# EAGLE design relay-shield (EAGLE 7.2.0)
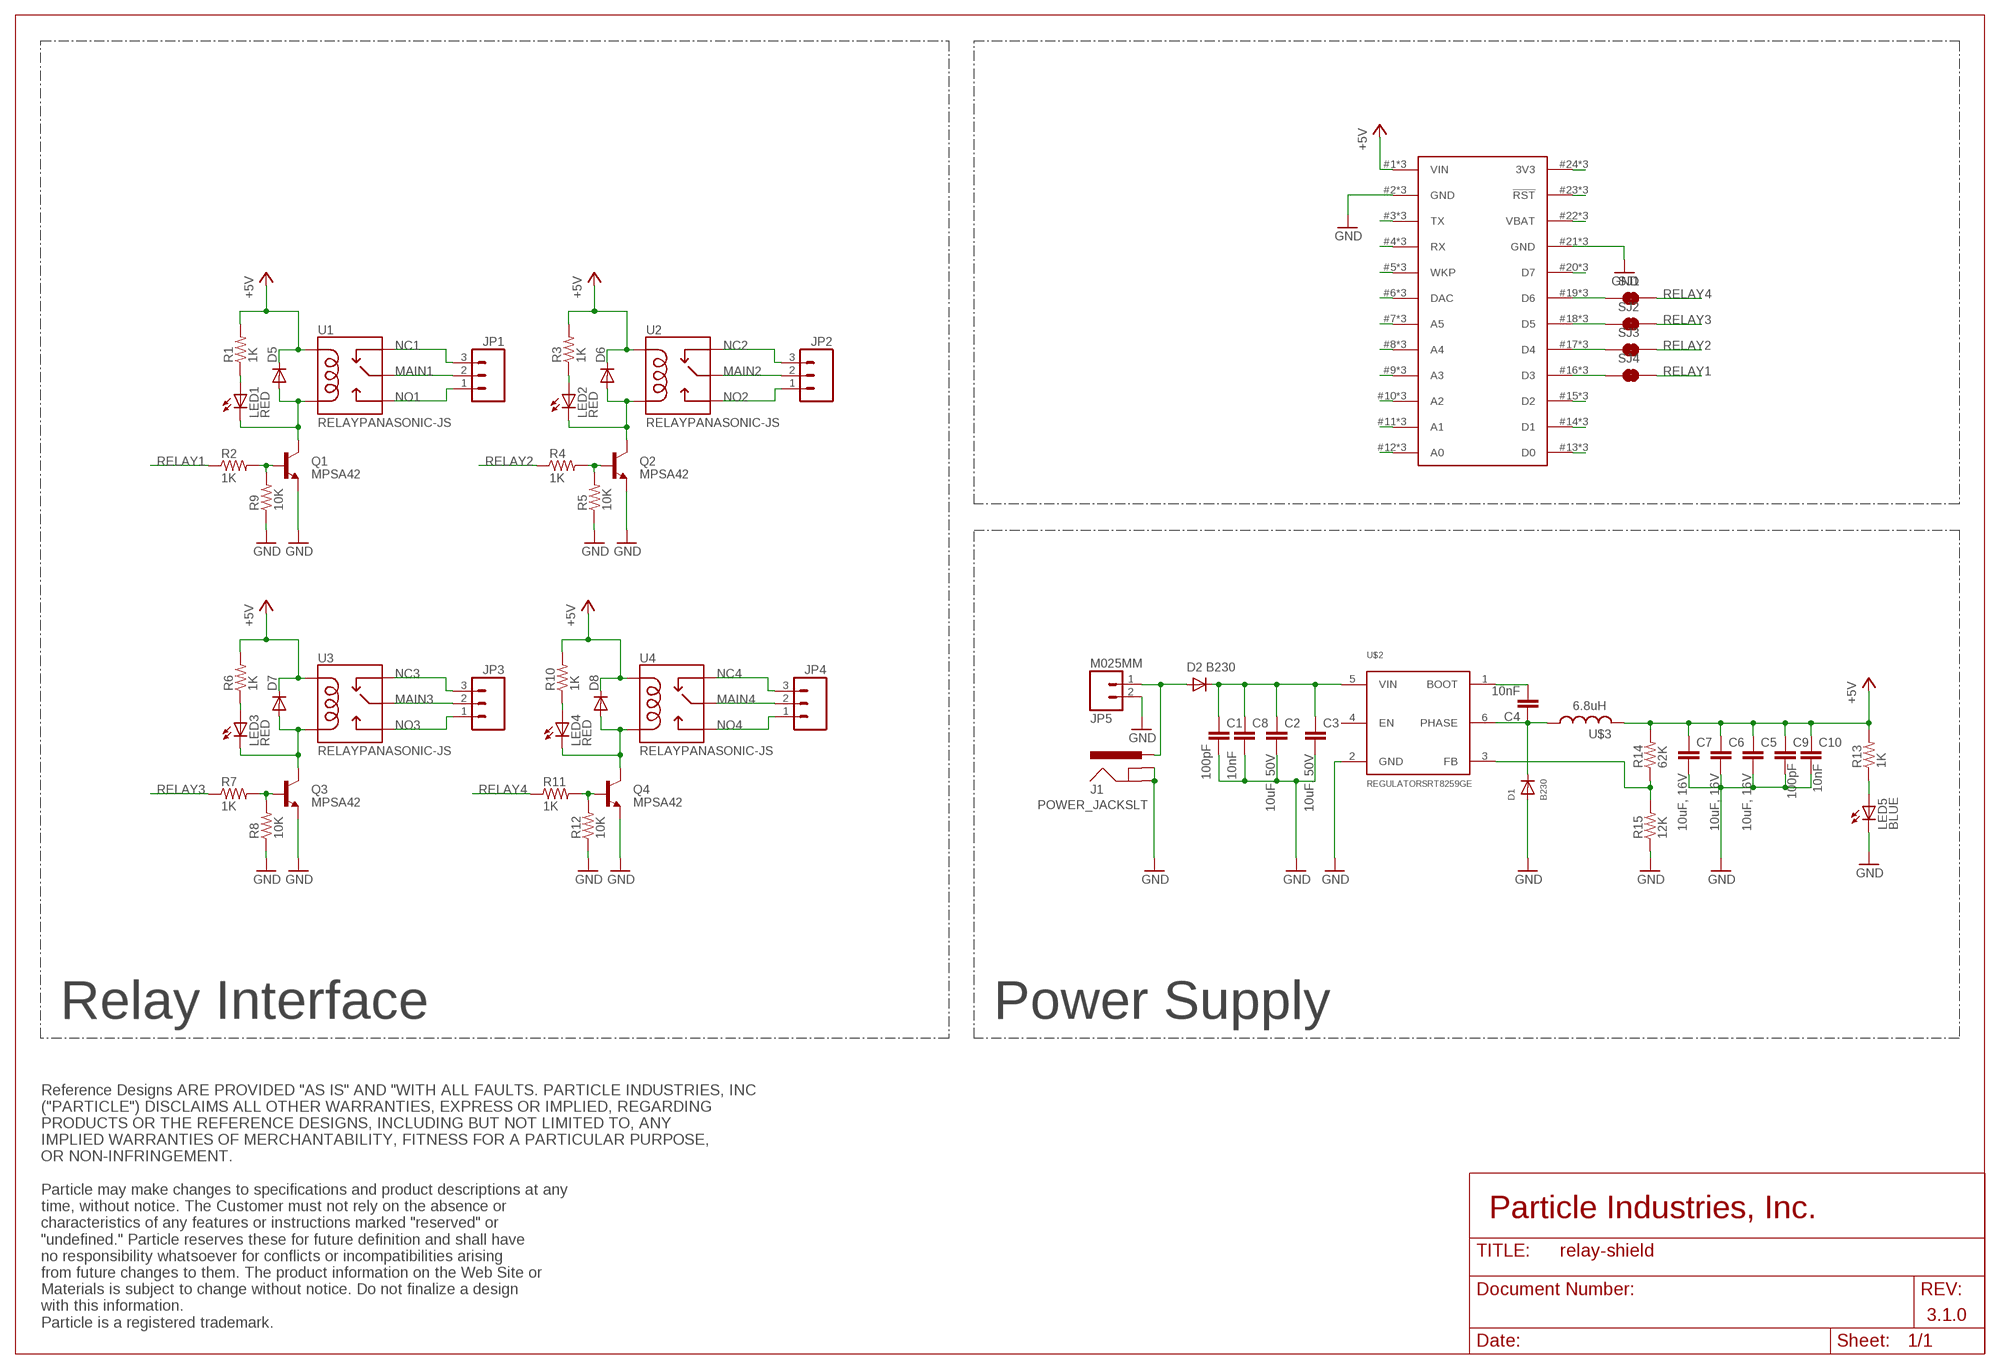
[diagram p0: schematic, sheet 1]

## Parts
C1  100pF  C-EUC0603  [C0603]
C2  10uF, 50V  CAP1206  [1206]
C3  10uF, 50V  CAP1206  [1206]
C4  10nF  CAP0603-CAP  [0603-CAP]
C5  10uF, 16V  CAP1206  [1206]
C6  10uF, 16V  CAP1206  [1206]
C7  10uF, 16V  CAP1206  [1206]
C8  10nF  C-EUC0603  [C0603]
C9  100pF  C-EUC0603  [C0603]
C10  10nF  C-EUC0603  [C0603]
D1  B230  DIODESMA  [SMADIODE]
D2  B230  DIODESMA  [SMADIODE]
D5  DIODE-SOD123  [SOD123]
D6  DIODE-SOD123  [SOD123]
D7  DIODE-SOD123  [SOD123]
D8  DIODE-SOD123  [SOD123]
J1  POWER_JACKSLT  [POWER_JACK_SLOT]
JP1  M03-SCREW-5MM  [SCREWTERMINAL-5MM-3]
JP2  M03-SCREW-5MM  [SCREWTERMINAL-5MM-3]
JP3  M03-SCREW-5MM  [SCREWTERMINAL-5MM-3]
JP4  M03-SCREW-5MM  [SCREWTERMINAL-5MM-3]
JP5  M025MM  [SCREWTERMINAL-5MM-2]
LED1  RED  LED0603  [LED-0603]
LED2  RED  LED0603  [LED-0603]
LED3  RED  LED0603  [LED-0603]
LED4  RED  LED0603  [LED-0603]
LED5  BLUE  LED0603  [LED-0603]
Q1  MPSA42  TRANSISTOR_NPNMPSA42  [SOT23]
Q2  MPSA42  TRANSISTOR_NPNMPSA42  [SOT23]
Q3  MPSA42  TRANSISTOR_NPNMPSA42  [SOT23]
Q4  MPSA42  TRANSISTOR_NPNMPSA42  [SOT23]
R1  1K  RESISTOR0603-RES  [0603-RES]
R2  1K  RESISTOR0603-RES  [0603-RES]
R3  1K  RESISTOR0603-RES  [0603-RES]
R4  1K  RESISTOR0603-RES  [0603-RES]
R5  10K  RESISTOR0603-RES  [0603-RES]
R6  1K  RESISTOR0603-RES  [0603-RES]
R7  1K  RESISTOR0603-RES  [0603-RES]
R8  10K  RESISTOR0603-RES  [0603-RES]
R9  10K  RESISTOR0603-RES  [0603-RES]
R10  1K  RESISTOR0603-RES  [0603-RES]
R11  1K  RESISTOR0603-RES  [0603-RES]
R12  10K  RESISTOR0603-RES  [0603-RES]
R13  1K  RESISTOR0603-RES  [0603-RES]
R14  62K  RESISTOR0603-RES  [0603-RES]
R15  12K  RESISTOR0603-RES  [0603-RES]
SJ1  JUMPER-PAD-2-NC_BY_TRACE  [PAD-JUMPER-2-NC_BY_TRACE_YES_SILK]
SJ2  JUMPER-PAD-2-NC_BY_TRACE  [PAD-JUMPER-2-NC_BY_TRACE_YES_SILK]
SJ3  JUMPER-PAD-2-NC_BY_TRACE  [PAD-JUMPER-2-NC_BY_TRACE_YES_SILK]
SJ4  JUMPER-PAD-2-NC_BY_TRACE  [PAD-JUMPER-2-NC_BY_TRACE_YES_SILK]
U1  RELAYPANASONIC-JS  [JS1-5V-F]
U2  RELAYPANASONIC-JS  [JS1-5V-F]
U3  RELAYPANASONIC-JS  [JS1-5V-F]
U4  RELAYPANASONIC-JS  [JS1-5V-F]
U$1  SPARK_CORESTACKABLE  [SPARK_CORE_STACKABLE]
U$2  REGULATORSRT8259GE  [SOT23-6]
U$3  INDUCTORS  [NR8040T6R8N]

## Nets
+5V: C5.1 C6.1 C7.1 C9.1 C10.1 D5.C D6.C D7.C D8.C R1.2 R3.2 R6.2 R10.2 R13.2 R14.2 U1.COIL1 U2.COIL1 U3.COIL1 U4.COIL1 U$1.1(VIN) U$1.#1(VIN) U$1.@1(VIN) U$3.P$2
GND: C1.2 C2.2 C3.2 C5.2 C6.2 C7.2 C8.2 C9.2 C10.2 D1.A J1.GND@1(GNDBREAK) J1.GND@2(GND) JP5.2 LED5.C Q1.2(E) Q2.2(E) Q3.2(E) Q4.2(E) R5.1 R8.1 R9.1 R12.1 R15.1 U$1.2(GND) U$1.21(GND) U$1.#2(GND) U$1.#21(GND) U$1.@2(GND) U$1.@21(GND) U$2.2(GND)
MAIN1: JP1.2 U1.COMMON(MAIN)
MAIN2: JP2.2 U2.COMMON(MAIN)
MAIN3: JP3.2 U3.COMMON(MAIN)
MAIN4: JP4.2 U4.COMMON(MAIN)
N$1: D5.A LED1.C Q1.3(C) U1.COIL2
N$2: Q2.1(B) R4.2 R5.2
N$3: Q1.1(B) R2.2 R9.2
N$4: LED1.A R1.1
N$5: D6.A LED2.C Q2.3(C) U2.COIL2
N$6: LED2.A R3.1
N$7: Q3.1(B) R7.2 R8.2
N$8: D7.A LED3.C Q3.3(C) U3.COIL2
N$9: LED3.A R6.1
N$10: Q4.1(B) R11.2 R12.2
N$11: D8.A LED4.C Q4.3(C) U4.COIL2
N$12: LED4.A R10.1
N$13: U$1.15(D2) U$1.#15(D2) U$1.@15(D2)
N$14: C1.1 C2.1 C3.1 C8.1 D2.C U$2.5(VIN)
N$15: U$1.14(D1) U$1.#14(D1) U$1.@14(D1)
N$16: LED5.A R13.1
N$17: U$1.13(D0) U$1.#13(D0) U$1.@13(D0)
N$18: U$1.20(D7) U$1.#20(D7) U$1.@20(D7)
N$19: U$1.22(VBAT) U$1.#22(VBAT) U$1.@22(VBAT)
N$20: U$1.23(!RST) U$1.#23(!RST) U$1.@23(!RST)
N$21: U$1.24(3V3) U$1.#24(3V3) U$1.@24(3V3)
N$22: U$1.12(A0) U$1.#12(A0) U$1.@12(A0)
N$23: U$1.11(A1) U$1.#11(A1) U$1.@11(A1)
N$24: U$1.10(A2) U$1.#10(A2) U$1.@10(A2)
N$25: U$1.9(A3) U$1.#9(A3) U$1.@9(A3)
N$26: U$1.8(A4) U$1.#8(A4) U$1.@8(A4)
N$27: U$1.7(A5) U$1.#7(A5) U$1.@7(A5)
N$28: U$1.6(DAC) U$1.#6(DAC) U$1.@6(DAC)
N$29: U$1.5(WKP) U$1.#5(WKP) U$1.@5(WKP)
N$30: U$1.4(RX) U$1.#4(RX) U$1.@4(RX)
N$31: U$1.3(TX) U$1.#3(TX) U$1.@3(TX)
N$32: D2.A J1.PWR JP5.1
N$34: SJ1.1 U$1.19(D6) U$1.#19(D6) U$1.@19(D6)
N$35: C4.1 D1.C U$2.6(PHASE) U$3.P$1
N$36: C4.2 U$2.1(BOOT)
N$143: SJ2.1 U$1.18(D5) U$1.#18(D5) U$1.@18(D5)
N$144: R14.1 R15.2 U$2.3(FB)
N$145: SJ3.1 U$1.17(D4) U$1.#17(D4) U$1.@17(D4)
N$146: SJ4.1 U$1.16(D3) U$1.#16(D3) U$1.@16(D3)
NC1: JP1.3 U1.CLOSED(NC)
NC2: JP2.3 U2.CLOSED(NC)
NC3: JP3.3 U3.CLOSED(NC)
NC4: JP4.3 U4.CLOSED(NC)
NO1: JP1.1 U1.OPEN(NO)
NO2: JP2.1 U2.OPEN(NO)
NO3: JP3.1 U3.OPEN(NO)
NO4: JP4.1 U4.OPEN(NO)
RELAY1: R2.1 SJ4.2
RELAY2: R4.1 SJ3.2
RELAY3: R7.1 SJ2.2
RELAY4: R11.1 SJ1.2
Unconnected: U$2.4(EN)

## Notes on the sheet
- 6.8uH
- Relay Interface | Power Supply
- Particle Industries, Inc.
- 3.1.0
- Reference Designs ARE PROVIDED "AS IS" AND "WITH ALL FAULTS. PARTICLE INDUSTRIES, INC 
  ("PARTICLE") DISCLAIMS ALL OTHER WARRANTIES, EXPRESS OR IMPLIED, REGARDING 
  PRODUCTS OR THE REFERENCE DESIGNS, INCLUDING BUT NOT LIMITED TO, ANY 
  IMPLIED WARRANTIES OF MERCHANTABILITY, FITNESS FOR A PARTICULAR PURPOSE,
  OR NON-INFRINGEMENT.
  
  Particle may make changes to specifications and product descriptions at any 
  time, without notice. The Customer must not rely on the absence or 
  characteristics of any features or instructions marked "reserved" or 
  "undefined." Particle reserves these for future definition and shall have 
  no responsibility whatsoever for conflicts or incompatibilities arising 
  from future changes to them. The product information on the Web Site or 
  Materials is subject to change without notice. Do not finalize a design 
  with this information. 
  Particle is a registered trademark.

## Library data of the parts
C1 C8-C10 = rcl:C-EU: CAPACITOR, European symbol
C2-C7 = SparkFun-Capacitors:CAP: Capacitor Standard 0603 ceramic capacitor, and 0.1" leaded capacitor.
D1 D2 = adafruit:DIODE: Diode SMADIODE - SMA Surface Mount Package 20V 1A Schottky Diode Digikey: 641-1014-6-ND DO-1N4148 - Through Hole Small Current Diode SOD-123 20V 1 A (.5mV Vf) Schottky Diode - Digikey: MBRX120TPMSCT-ND SOD-323 10V 570mA (.38mV Vf, 3ns) Schottky Diode - Digikey: ZLLS410CT-ND SOD-523 30V 30mA Schottky Diode (RB751S-40TE61) - Digikey: RB751S-40TE61CT-ND SOT23-R/W - SOT23 Package (R = Solder Paste/Reflow Ovens, W = Hand-Soldering) BAT54Film 40V 300mA - Digikey: 497-7162-1-ND
D5-D8 = diode:DIODE-: DIODE
J1 = Spark:POWER_JACK: Power Jack This is the standard 5.5mm barrel jack for power. The PTH is the most common, proven, reliable, footprint. The Slot footprint only works if the mill layer is transmitted to the PCB fab house so be warned. Spark Fun Electronics SKU : PRT-00119 SMT: CONN-08106 Mating wall wart : TOL-00298 (and others)
JP1-JP4 = SparkFun-Connectors:M03: Header 3 Standard 3-pin 0.1" header. Use with straight break away headers (SKU : PRT-00116), right angle break away headers (PRT-00553), swiss pins (PRT-00743), machine pins (PRT-00117), and female headers (PRT-00115). Molex polarized connector foot print use with SKU : PRT-08232 with associated crimp pins and housings.
JP5 = SparkFun-Connectors:M02: Standard 2-pin 0.1" header. Use with - straight break away headers ( PRT-00116) - right angle break away headers (PRT-00553) - swiss pins (PRT-00743) - machine pins (PRT-00117) - female headers (PRT-00115) Molex polarized connector foot print use with: PRT-08233 with associated crimp pins and housings. 2.54_SCREWTERM for use with PRT-10571. 3.5mm Screw Terminal footprints for PRT-08084 5mm Screw Terminal footprints for use with PRT-08433
LED1-LED5 = SparkFun-LED:LED: LEDs Standard schematic elements and footprints for 5mm, 3mm, 1206, and 0603 sized LEDs. 5mm - Spark Fun Electronics SKU : COM-00529 (and others)
Q1-Q4 = SparkFun-DiscreteSemi:TRANSISTOR_NPN: Generic NPN BJT MMBT2222A - TRANS-08049 (SOT-23, 1A 40V) MPSA42 - TRANS-09116 (SOT-23, 500mA 300V) MMBT5088LT1G - TRANS-11160 (SOT-23, 50 mA 30V); PROD_ID: TRANS-09116
R1-R15 = SparkFun-Passives:RESISTOR: Resistor Basic schematic elements and footprints for 0603, 1206, and PTH resistors.
SJ1-SJ4 = SparkFun-Passives:JUMPER-PAD-2-NC_BY_TRACE
U1-U4 = Spark:RELAY: SPDT relay (COM-00101)
U$1 = Spark:SPARK_CORE
U$2 = mohit-eagle:REGULATORS
U$3 = mohit-eagle:INDUCTORS

## Board
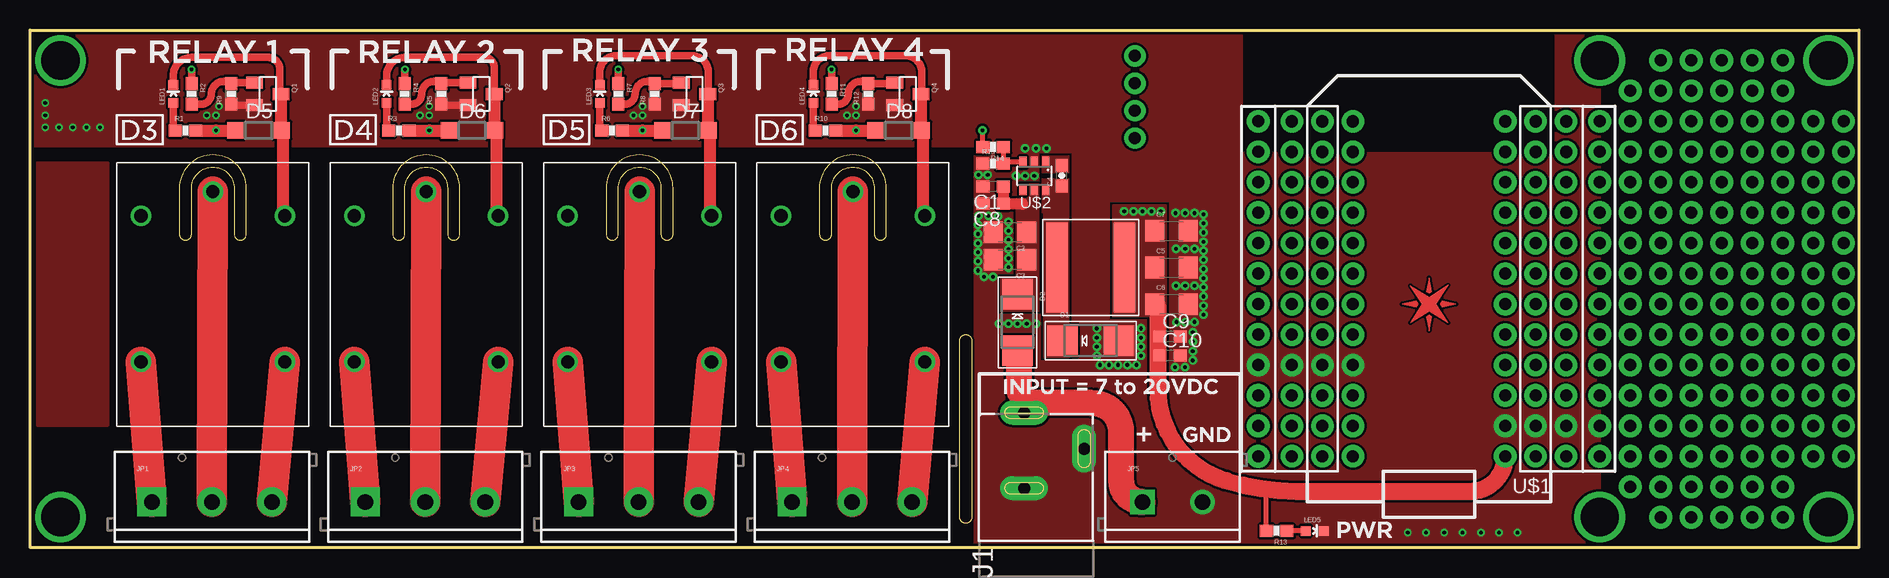
[diagram p1: board, top side]
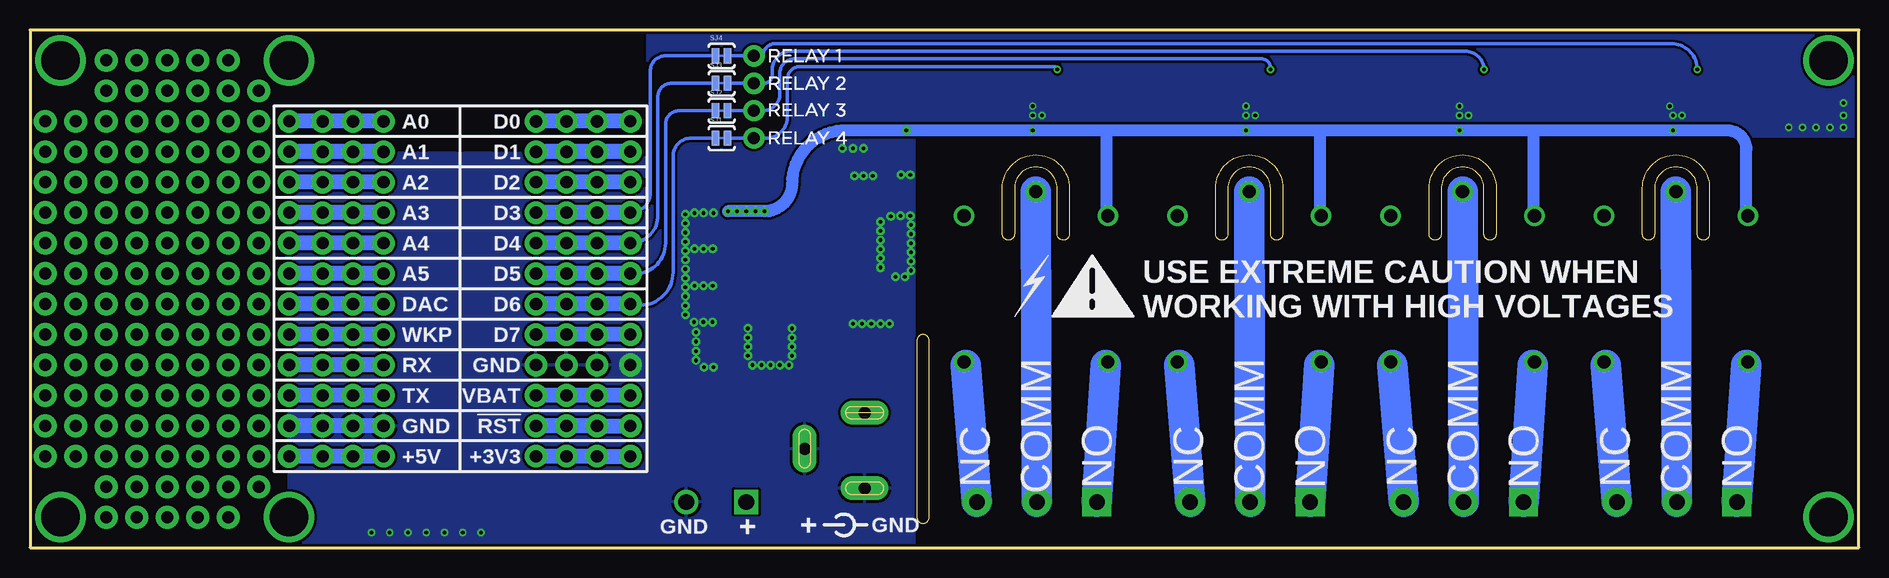
[diagram p2: board, bottom side, seen from below]

Size 152.4 x 43.18 mm. Coordinates in mm from the lower left corner, seen from the top.
Outline: 13.46,26.16 13.46,29.97 arc-90 15.24,31.75 arc-90 17.02,29.97 17.02,26.16 arc180 18.03,26.16 18.03,29.97 arc90 15.24,32.77 arc85 12.45,30.23 12.45,26.16 arc180 13.46,26.16
Outline: 31.24,26.16 31.24,29.97 arc-90 33.02,31.75 arc-90 34.8,29.97 34.8,26.16 arc180 35.81,26.16 35.81,29.97 arc90 33.02,32.77 arc85 30.23,30.23 30.23,26.16 arc180 31.24,26.16
Outline: 49.02,26.16 49.02,29.97 arc-90 50.8,31.75 arc-90 52.58,29.97 52.58,26.16 arc180 53.59,26.16 53.59,29.97 arc90 50.8,32.77 arc85 48.01,30.23 48.01,26.16 arc180 49.02,26.16
Outline: 66.8,26.16 66.8,29.97 arc-90 68.58,31.75 arc-90 70.36,29.97 70.36,26.16 arc180 71.37,26.16 71.37,29.97 arc90 68.58,32.77 arc85 65.79,30.23 65.79,26.16 arc180 66.8,26.16
Outline: 0,0 0,43.18 152.4,43.18 152.4,0 0,0
Outline: 77.47,2.54 77.47,17.27 arc-90 77.98,17.78 arc-90 78.49,17.27 78.49,2.54 arc-90 77.98,2.03 arc-90 77.47,2.54
Copper layers (1*16): Top 0.035mm / dielectric 1.5mm / Bottom 0.035mm
Design rules "SparkFun-2-layer *": minimum track width 7mil, minimum drill 15mil, track to track 8mil, track to pad 8mil, pad to pad 8mil, via to via 8mil, smd to smd 8mil, copper to edge 8mil, drill to drill 8mil, minimum pad ring 12mil, minimum via ring 6mil, stop-mask expansion 4mil, vias tented up to drill 20mil, thermal gap 10mil
tRestrict: area 101.1,33 to 127,43.2
bRestrict: area 101.1,33 to 127,43.2

### Footprints (pad centres in the part's own frame; a part is rotated, then mirrored left to right if it is on the bottom)
C0603 = smd 1.1 x 1: 1 -0.85,0; 2 0.85,0
1206 = smd 1.6 x 1.8: 1 -1.4,0; 2 1.4,0
0603-CAP = smd 1.1 x 1: 1 -0.85,0; 2 0.85,0
SMADIODE = smd 2.54 x 2.54: A 2.349,0; C -2.349,0
SOD123 = smd 1.4 x 1.4: A 1.9,0; C -1.9,0
POWER_JACK_SLOT = drill 1 pad 2 long: GND@1 2.58,7.5; GND@2 7.58,10.8; PWR 2.58,13.8
SCREWTERMINAL-5MM-3 = drill 1.3 pad 2.413 square: 1 0,0 | drill 1.3 pad 2.413: 2 5,0; 3 10,0
SCREWTERMINAL-5MM-2 = drill 1.3 pad 2.032 square: 1 0,0 | drill 1.3 pad 2.032: 2 5,0
LED-0603 = smd 0.8 x 0.8: A 0,-0.75; C 0,0.75
SOT23 = smd 1 x 1.4: 1 -0.95,-1.1; 2 0.95,-1.1; 3 0,1.1
0603-RES = smd 1.1 x 1: 1 -0.85,0; 2 0.85,0
PAD-JUMPER-2-NC_BY_TRACE_YES_SILK = smd 0.635 x 1.27: 1 -0.508,0; 2 0.508,0
JS1-5V-F = drill 1.1: CLOSED -6.096,-5.994; COIL1 6.096,5.994; COIL2 6.096,-5.994; COMMON 8.103,0; OPEN -6.096,5.994
SPARK_CORE_STACKABLE = drill 1.016 pad 1.88: 1 -8.89,13.97; 2 -8.89,11.43; 3 -8.89,8.89; 4 -8.89,6.35; 5 -8.89,3.81; 6 -8.89,1.27; 7 -8.89,-1.27; 8 -8.89,-3.81; 9 -8.89,-6.35; 10 -8.89,-8.89; 11 -8.89,-11.43; 12 -8.89,-13.97; 13 8.89,-13.97; 14 8.89,-11.43; 15 8.89,-8.89; 16 8.89,-6.35; 17 8.89,-3.81; 18 8.89,-1.27; 19 8.89,1.27; 20 8.89,3.81; 21 8.89,6.35; 22 8.89,8.89; 23 8.89,11.43; 24 8.89,13.97; #1 -6.35,13.97; #2 -6.35,11.43; #3 -6.35,8.89; #4 -6.35,6.35; #5 -6.35,3.81; #6 -6.35,1.27; #7 -6.35,-1.27; #8 -6.35,-3.81; #9 -6.35,-6.35; #10 -6.35,-8.89; #11 -6.35,-11.43; #12 -6.35,-13.97; #13 11.43,-13.97; #14 11.43,-11.43; #15 11.43,-8.89; #16 11.43,-6.35; #17 11.43,-3.81; #18 11.43,-1.27; #19 11.43,1.27; #20 11.43,3.81; #21 11.43,6.35; #22 11.43,8.89; #23 11.43,11.43; #24 11.43,13.97; @1 -11.43,13.97; @2 -11.43,11.43; @3 -11.43,8.89; @4 -11.43,6.35; @5 -11.43,3.81; @6 -11.43,1.27; @7 -11.43,-1.27; @8 -11.43,-3.81; @9 -11.43,-6.35; @10 -11.43,-8.89; @11 -11.43,-11.43; @12 -11.43,-13.97; @13 6.35,-13.97; @14 6.35,-11.43; @15 6.35,-8.89; @16 6.35,-6.35; @17 6.35,-3.81; @18 6.35,-1.27; @19 6.35,1.27; @20 6.35,3.81; @21 6.35,6.35; @22 6.35,8.89; @23 6.35,11.43; @24 6.35,13.97
SOT23-6 = smd 0.6 x 0.9: 1 -0.95,-1.15; 2 0,-1.15; 3 0.95,-1.15; 4 0.95,1.15; 5 0,1.15; 6 -0.95,1.15
NR8040T6R8N = smd 1.8 x 7.5: P$1 -2.8,0; P$2 2.8,0

### Placement (x,y rotation side)
C1  80.26,30.12 180 top
C2  81.66,26.29 180 top
C3  81.66,24 180 top
C4  85.98,31.01 90 top
C5  95.12,23.37 0 top
C6  95.12,20.32 0 top
C7  95.12,26.42 0 top
C8  80.26,28.7 180 top
C9  95,17.63 0 top
C10  95,16.05 0 top
D1  88.39,17.27 0 top
D2  82.3,18.8 270 top
D5  19.05,34.8 0 top
D6  36.83,34.8 0 top
D7  54.61,34.8 0 top
D8  72.39,34.8 0 top
E$1  [SPARK_LOGO_PLUS_PLANE]  116.59,20.32 90 top
J1  80.26,-2.54 0 top
JP1  10.16,3.81 0 top
JP2  27.94,3.81 0 top
JP3  45.72,3.81 0 top
JP4  63.5,3.81 0 top
JP5  92.71,3.81 0 top
LED1  11.94,37.85 0 top
LED2  29.72,37.85 0 top
LED3  47.5,37.85 0 top
LED4  65.28,37.85 0 top
LED5  107.06,1.4 270 top
Q1  19.81,37.85 270 top
Q2  37.59,37.85 270 top
Q3  55.37,37.85 270 top
Q4  73.15,37.85 270 top
R1  12.95,34.8 0 top
R2  13.46,37.85 270 top
R3  30.73,34.8 0 top
R4  31.24,37.85 270 top
R5  34.29,37.85 90 top
R6  48.51,34.8 0 top
R7  49.02,37.85 270 top
R8  52.07,37.85 90 top
R9  16.76,37.85 90 top
R10  66.29,34.8 0 top
R11  66.8,37.85 270 top
R12  69.85,37.85 90 top
R13  103.89,1.4 180 top
R14  80.26,33.43 180 top
R15  80.24,32.03 0 top
SJ1  94.77,34.16 0 bottom
SJ2  94.77,36.45 0 bottom
SJ3  94.77,38.73 0 bottom
SJ4  94.77,41.02 0 bottom
U1  15.24,21.59 90 top
U2  33.02,21.59 90 top
U3  50.8,21.59 90 top
U4  68.58,21.59 90 top
U$1  116.59,21.59 180 top
U$2  83.69,31.01 180 top
U$3  88.39,23.37 0 top

### Tracks (layer width: path | path; a pad name or v marks a point on that pad's centre or on a via)
+5V  (via drill 0.3, 0.3 pad 0.71, 1 pad 1.9)
  Top 0.406: R14.2 79.41,34.76 arc90 v79.38,34.8 | R13.2 103.04,4.45 | 103.04,4.45 103.04,4.61 arc-90 103.25,4.83 | 99.69,5.59 103.04,4.45
  Top 0.914: C10.1 93.98,16.05 93.98,17.12 | C9.1 93.98,17.63 93.98,19.86
  Top 1.016: R1.2 v15.49,34.8 D5.C | R3.2 v33.27,34.8 D6.C | R6.2 v51.05,34.8 D7.C | R10.2 v68.83,34.8 D8.C | C6.1
  Top 1.422: C6.1 arc-90 93.98,20.06 93.98,19.86 93.98,17.12 93.98,13.21 arc74 99.69,5.59 arc19 107.06,4.7 120.02,4.7 arc90 U$1.#1
  Bottom 1.016: U1.COIL1 9.37,27.69 9.37,33.24 arc-90 10.92,34.8 v15.49,34.8 26.92,34.8 | U3.COIL1 44.92,27.69 44.92,34.58 44.7,34.8 | U4.COIL1 62.7,27.69 62.7,34.77 62.74,34.8 | U2.COIL1 27.14,27.69 27.14,34.58 26.92,34.8 | 26.92,34.8 v33.27,34.8 44.7,34.8 | 44.7,34.8 v51.05,34.8 62.74,34.8 | 62.74,34.8 v68.83,34.8 v79.38,34.8 84.45,34.8 arc-90 88.9,30.35 arc90 v91.19,28.07 | 90.81,28.07 v91.19,28.07 | v91.19,28.07 v94.23,28.07
  Bottom 1.27: U$1.#1 U$1.1 U$1.@1 v130.81,7.62
  other vias: 93.47,28.07 92.71,28.07 91.95,28.07
  pour Top (no thermals): 90.17,19.3 94.74,19.3 94.74,28.57 90.17,28.57
GND  (via drill 0.3, 0.3 pad 0.71, 1 pad 1.9)
  Top 0.61: Q2.2 34.39,36.9 R5.1 | Q1.2 16.86,36.9 R9.1
  Bottom 1.27: U$1.#2 U$1.2 U$1.@2 v130.81,10.16
  other vias: 14.73,36.07 15.49,36.07 15.75,36.83 33.27,36.07 32.51,36.07 33.27,36.83 51.05,36.07 51.05,36.83 50.29,36.07 68.83,36.07 68.83,36.83 68.07,36.07 1.27,36.07 1.27,37.08 1.27,35.05 123.95,1.27 122.43,1.27 120.9,1.27 119.38,1.27 117.86,1.27 116.33,1.27 114.81,1.27 2.41,35.05 3.56,35.05 4.7,35.05 5.84,35.05 82.17,31.01 78.99,26.92 78.99,26.16 78.99,25.4 78.99,24.64 78.99,23.88 78.99,23.11 79.5,22.61 95.45,27.91 96.27,27.91 97.03,27.91 97.79,27.81 97.79,27.05 97.79,26.29 97.79,25.53 97.79,24.77 97.79,24 97.79,23.24 97.79,22.48 97.79,21.72 97.79,20.95 97.79,20.19 97.79,19.43 97.05,18.82 96.29,18.82 95.53,18.82 97.03,21.84 96.27,21.84 97.03,24.92 96.27,24.92 95.5,24.92 95.5,21.84 89.15,15.24 89.92,15.24 90.68,15.24 91.44,15.24 92.2,15.24 92.58,16 92.58,16.76 92.58,17.53 92.58,18.29 88.9,16 88.9,16.76 88.9,17.53 88.9,18.29 83.82,18.67 82.93,31.01 83.69,31.01 83.82,33.3 84.71,33.3 82.93,33.3 81.53,27.18 81.53,26.42 81.53,25.65 81.53,24.89 81.53,24.13 81.53,23.37 80.26,22.61 83.06,18.67 82.3,18.67 81.53,18.67 80.77,18.67 96.9,17.96 96.9,17.2 96.9,16.38 96.9,15.62 96.24,15.06 95.43,15.06 79.04,27.69 79.86,27.69 79.04,31.09 79.81,31.09 80.67,27.64 102.36,15.24
  pour Bottom (rank 2): 130.81,0 130.81,43.18 0,43.18 0,34.29 78.74,34.29 78.74,0
  pour Top (rank 2, no thermals): 130.81,0 130.81,43.18 0,43.18 0,33.53 78.74,33.53 78.74,0
MAIN1
  Top 2.54: JP1.2 U1.COMMON
  Bottom 2.54: JP1.2 15.24,29.72
MAIN2
  Top 2.54: JP2.2 U2.COMMON
  Bottom 2.54: JP2.2 33.02,29.72
MAIN3
  Top 2.54: JP3.2 U3.COMMON
  Bottom 2.54: JP3.2 50.8,29.72
MAIN4
  Top 2.54: JP4.2 U4.COMMON
  Bottom 2.54: JP4.2 68.58,29.72
N$1
  Top 0.406: 20.83,37.93 Q1.3
  Top 0.61: LED1.C 11.94,39.37 arc-90 13.46,40.89 19.81,40.89 arc-90 20.83,39.88 20.83,37.93 arc90 Q1.3
  Top 1.016: U1.COIL2 21.11,27.69 21.11,34.63 D5.A 20.95,37.81 Q1.3
N$2
  Top 0.61: Q2.1 34.39,38.8 R5.2 | 34.2,38.61 R5.2 | R4.2 31.79,37 arc90 32.64,37.85 arc-126 R5.2
N$3
  Top 0.61: Q1.1 16.86,38.8 R9.2 | 16.68,38.61 R9.2 | R2.2 14.26,37 arc90 15.11,37.85 arc-126 R9.2
N$4
  Top 0.61: LED1.A 11.94,34.96 R1.1
N$5
  Top 0.406: 38.86,38.02 Q2.3
  Top 0.61: LED2.C 29.72,39.37 arc-90 31.24,40.89 37.85,40.89 arc-90 38.69,40.05 Q2.3 arc90 38.86,38.02
  Top 1.016: U2.COIL2 38.9,27.69 38.9,34.63 D6.A 38.73,37.81 Q2.3
N$6
  Top 0.61: LED2.A 29.72,34.96 R3.1
N$7
  Top 0.61: 51.98,38.61 R8.2 | R8.2 54.17,38.7 Q3.1 | R7.2 49.57,37 arc90 50.42,37.85 arc-126 R8.2
N$8
  Top 0.406: 56.39,38.18 Q3.3
  Top 0.61: LED3.C 47.5,39.88 arc-90 49.02,41.02 54.99,41.02 arc-90 56.52,39.88 56.52,37.89 arc-90 Q3.3
  Top 1.016: U3.COIL2 56.67,27.69 56.67,34.63 D7.A 56.51,37.3 Q3.3
N$9
  Top 0.61: LED3.A 47.5,34.96 R6.1
N$10
  Top 0.61: 69.76,38.61 R12.2 | R12.2 71.95,38.7 Q4.1 | R11.2 67.35,37 arc90 68.2,37.85 arc-126 R12.2
N$11
  Top 0.61: LED4.C 65.28,39.88 arc-90 66.8,41.02 72.77,41.02 arc-90 74.3,39.88 74.3,37.89 arc-90 Q4.3
  Top 1.016: U4.COIL2 74.45,27.69 74.45,34.63 D8.A 74.29,37.55 Q4.3
N$12
  Top 0.61: LED4.A 65.28,34.96 R10.1
N$13  (via drill 1 pad 1.9)
  Bottom 1.27: v102.36,30.48 U$1.#15 U$1.15 U$1.@15
N$14
  Top 0.914: 82.7,28.65 82.7,28.7 C8.1 C1.1
  pour Top (no thermals): 84.07,30.38 84.07,19.68 80.9,19.68 80.9,22.61 82.17,22.61 82.17,29.16 83.08,29.16 83.31,29.39 83.31,30.38
N$15  (via drill 1 pad 1.9)
  Bottom 1.27: v102.36,33.02 U$1.#14 U$1.14 U$1.@14
N$16
  Top 0.406: LED5.A R13.1
N$17  (via drill 1 pad 1.9)
  Bottom 1.27: v102.36,35.56 U$1.#13 U$1.13 U$1.@13
N$18  (via drill 1 pad 1.9)
  Bottom 1.27: v102.36,17.78 U$1.#20 U$1.20 U$1.@20
N$19  (via drill 1 pad 1.9)
  Bottom 1.27: v102.36,12.7 U$1.#22 U$1.22 U$1.@22
N$20  (via drill 1 pad 1.9)
  Bottom 1.27: v102.36,10.16 U$1.#23 U$1.23 U$1.@23
N$21  (via drill 1 pad 1.9)
  Bottom 1.27: v102.36,7.62 U$1.#24 U$1.24 U$1.@24
N$22  (via drill 1 pad 1.9)
  Bottom 1.27: U$1.#12 U$1.12 U$1.@12 v130.81,35.56
N$23  (via drill 1 pad 1.9)
  Bottom 1.27: U$1.#11 U$1.11 U$1.@11 v130.81,33.02
N$24  (via drill 1 pad 1.9)
  Bottom 1.27: U$1.#10 U$1.10 U$1.@10 v130.81,30.48
N$25  (via drill 1 pad 1.9)
  Bottom 1.27: U$1.#9 U$1.9 U$1.@9 v130.81,27.94
N$26  (via drill 1 pad 1.9)
  Bottom 1.27: U$1.#8 U$1.8 U$1.@8 v130.81,25.4
N$27  (via drill 1 pad 1.9)
  Bottom 1.27: U$1.#7 U$1.7 U$1.@7 v130.81,22.86
N$28  (via drill 1 pad 1.9)
  Bottom 1.27: U$1.#6 U$1.6 U$1.@6 v130.81,20.32
N$29  (via drill 1 pad 1.9)
  Bottom 1.27: U$1.#5 U$1.5 U$1.@5 v130.81,17.78
N$30  (via drill 1 pad 1.9)
  Bottom 1.27: U$1.#4 U$1.4 U$1.@4 v130.81,15.24
N$31  (via drill 1 pad 1.9)
  Bottom 1.27: U$1.#3 U$1.3 U$1.@3 v130.81,12.7
N$32
  Top 1.016: J1.PWR 83.82,11.26 83.82,12.06
  Top 2.184: JP5.1 arc-90 90.93,5.59 90.93,9.65 arc90 88.52,12.06 83.82,12.06 arc-90 82.42,13.46 82.42,16.32 arc90 D2.A
N$34  (via drill 1 pad 1.9)
  Bottom 0.305: SJ1.1 97.28,34.16 arc-90 98.81,32.64 98.81,22.99 arc106 v102.36,20.32 | 103.76,20.32 U$1.#19
  Bottom 1.27: U$1.@19 U$1.19 U$1.#19 v102.36,20.32
N$35
  pour Top (no thermals): 84.33,27.94 84.45,27.94 84.45,15.88 86.61,15.88 86.61,30.76 84.33,30.76
N$36
  pour Top (no thermals): 84.33,32.66 84.33,31.27 86.61,31.27 86.61,32.66
N$38  (via drill 1 pad 1.9)
  other vias: 135.89,7.62
N$39  (via drill 1 pad 1.9)
  other vias: 135.89,10.16
N$40  (via drill 1 pad 1.9)
  other vias: 135.89,12.7
N$41  (via drill 1 pad 1.9)
  other vias: 135.89,15.24
N$42  (via drill 1 pad 1.9)
  other vias: 135.89,17.78
N$43  (via drill 1 pad 1.9)
  other vias: 135.89,20.32
N$44  (via drill 1 pad 1.9)
  other vias: 135.89,22.86
N$45  (via drill 3.2)
  other vias: 149.86,2.54
N$46  (via drill 1 pad 1.9)
  other vias: 135.89,27.94
N$47  (via drill 1 pad 1.9)
  other vias: 135.89,30.48
N$48  (via drill 1 pad 1.9)
  other vias: 135.89,33.02
N$49  (via drill 1 pad 1.9)
  other vias: 133.35,7.62
N$51  (via drill 1 pad 1.9)
  other vias: 146.05,35.56
N$53  (via drill 1 pad 1.9)
  other vias: 138.43,7.62
N$54  (via drill 1 pad 1.9)
  other vias: 138.43,10.16
N$55  (via drill 1 pad 1.9)
  other vias: 138.43,12.7
N$56  (via drill 1 pad 1.9)
  other vias: 138.43,15.24
N$57  (via drill 1 pad 1.9)
  other vias: 138.43,17.78
N$58  (via drill 1 pad 1.9)
  other vias: 138.43,20.32
N$59  (via drill 1 pad 1.9)
  other vias: 138.43,22.86
N$60  (via drill 1 pad 1.9)
  other vias: 138.43,25.4
N$61  (via drill 1 pad 1.9)
  other vias: 138.43,27.94
N$62  (via drill 1 pad 1.9)
  other vias: 138.43,30.48
N$63  (via drill 1 pad 1.9)
  other vias: 138.43,33.02
N$64  (via drill 1 pad 1.9)
  other vias: 138.43,35.56
N$66  (via drill 1 pad 1.9)
  other vias: 146.05,33.02
N$68  (via drill 1 pad 1.9)
  other vias: 140.97,7.62
N$69  (via drill 1 pad 1.9)
  other vias: 140.97,10.16
N$70  (via drill 1 pad 1.9)
  other vias: 140.97,12.7
N$71  (via drill 1 pad 1.9)
  other vias: 140.97,15.24
N$72  (via drill 1 pad 1.9)
  other vias: 140.97,17.78
N$73  (via drill 1 pad 1.9)
  other vias: 140.97,20.32
N$74  (via drill 1 pad 1.9)
  other vias: 140.97,22.86
N$75  (via drill 1 pad 1.9)
  other vias: 140.97,25.4
N$76  (via drill 1 pad 1.9)
  other vias: 140.97,27.94
N$77  (via drill 1 pad 1.9)
  other vias: 140.97,30.48
N$78  (via drill 1 pad 1.9)
  other vias: 140.97,33.02
N$79  (via drill 1 pad 1.9)
  other vias: 140.97,35.56
N$81  (via drill 1 pad 1.9)
  other vias: 146.05,30.48
N$83  (via drill 1 pad 1.9)
  other vias: 143.51,7.62
N$84  (via drill 1 pad 1.9)
  other vias: 143.51,10.16
N$85  (via drill 1 pad 1.9)
  other vias: 143.51,12.7
N$86  (via drill 1 pad 1.9)
  other vias: 143.51,15.24
N$87  (via drill 1 pad 1.9)
  other vias: 143.51,17.78
N$88  (via drill 1 pad 1.9)
  other vias: 143.51,20.32
N$89  (via drill 1 pad 1.9)
  other vias: 143.51,22.86
N$90  (via drill 1 pad 1.9)
  other vias: 143.51,25.4
N$91  (via drill 1 pad 1.9)
  other vias: 143.51,27.94
N$92  (via drill 1 pad 1.9)
  other vias: 143.51,30.48
N$93  (via drill 1 pad 1.9)
  other vias: 143.51,33.02
N$94  (via drill 1 pad 1.9)
  other vias: 143.51,35.56
N$96  (via drill 1 pad 1.9)
  other vias: 146.05,27.94
N$97  (via drill 1 pad 1.9)
  other vias: 146.05,25.4
N$98  (via drill 1 pad 1.9)
  other vias: 146.05,22.86
N$99  (via drill 1 pad 1.9)
  other vias: 146.05,20.32
N$100  (via drill 1 pad 1.9)
  other vias: 146.05,17.78
N$101  (via drill 1 pad 1.9)
  other vias: 146.05,15.24
N$102  (via drill 1 pad 1.9)
  other vias: 146.05,12.7
N$103  (via drill 1 pad 1.9)
  other vias: 146.05,10.16
N$104  (via drill 1 pad 1.9)
  other vias: 146.05,7.62
N$105  (via drill 3.2)
  other vias: 149.86,40.64
N$106  (via drill 1 pad 1.9)
  other vias: 151.13,7.62
N$107  (via drill 1 pad 1.9)
  other vias: 138.43,2.54
N$108  (via drill 1 pad 1.9)
  other vias: 138.43,5.08
N$109  (via drill 1 pad 1.9)
  other vias: 140.97,5.08
N$110  (via drill 1 pad 1.9)
  other vias: 140.97,2.54
N$111  (via drill 1 pad 1.9)
  other vias: 143.51,2.54
N$112  (via drill 1 pad 1.9)
  other vias: 143.51,5.08
N$113  (via drill 1 pad 1.9)
  other vias: 146.05,5.08
N$114  (via drill 1 pad 1.9)
  other vias: 146.05,2.54
N$115  (via drill 3.2)
  other vias: 130.81,40.64
N$116  (via drill 3.2)
  other vias: 130.81,2.54
N$118  (via drill 1 pad 1.9)
  other vias: 135.89,5.08
N$119  (via drill 1 pad 1.9)
  other vias: 135.89,40.64
N$121  (via drill 1 pad 1.9)
  other vias: 146.05,38.1
N$122  (via drill 1 pad 1.9)
  other vias: 143.51,38.1
N$123  (via drill 1 pad 1.9)
  other vias: 140.97,38.1
N$125  (via drill 1 pad 1.9)
  other vias: 138.43,38.1
N$127  (via drill 1 pad 1.9)
  other vias: 148.59,33.02
N$128  (via drill 1 pad 1.9)
  other vias: 148.59,30.48
N$129  (via drill 1 pad 1.9)
  other vias: 148.59,27.94
N$130  (via drill 1 pad 1.9)
  other vias: 148.59,25.4
N$131  (via drill 1 pad 1.9)
  other vias: 148.59,22.86
N$132  (via drill 1 pad 1.9)
  other vias: 148.59,20.32
N$133  (via drill 1 pad 1.9)
  other vias: 148.59,17.78
N$134  (via drill 1 pad 1.9)
  other vias: 148.59,15.24
N$135  (via drill 1 pad 1.9)
  other vias: 148.59,12.7
N$136  (via drill 1 pad 1.9)
  other vias: 148.59,10.16
N$138
  pour Top: 0.64,32.13 6.48,32.13 6.48,10.16 0.64,10.16
N$139  (via drill 3.2)
  other vias: 2.54,40.64
N$140  (via drill 3.2)
  other vias: 2.54,2.54
N$143  (via drill 1 pad 1.9)
  Bottom 0.305: SJ2.1 98.3,36.45 arc-90 99.44,35.31 99.44,25.4 arc98 v102.36,22.86 | 103.76,22.86 U$1.#18
  Bottom 1.27: U$1.@18 U$1.18 U$1.#18 v102.36,22.86
N$144
  Top 0.406: U$2.3 81.15,32.16 | 81.15,32.16 R15.2 arc-90 81.1,31.81 | 81.15,32.16 81.06,32.16 | 81.15,32.16 81.15,33.39 arc90 R14.1
N$145  (via drill 1 pad 1.9)
  Bottom 0.305: SJ3.1 98.93,38.73 arc-90 100.08,37.59 100.08,27.69 arc90 v102.36,25.4 | 103.76,25.4 U$1.#17
  Bottom 1.27: U$1.@17 U$1.17 U$1.#17 v102.36,25.4
N$146  (via drill 1 pad 1.9)
  Bottom 0.305: SJ4.1 99.44,41.02 arc-90 100.71,39.75 100.71,29.59 arc90 v102.36,27.94
  Bottom 1.27: U$1.@16 U$1.16 U$1.#16 v102.36,27.94
N$147  (via drill 1 pad 1.78)
  other vias: 92.08,41.02
N$148  (via drill 1 pad 1.78)
  other vias: 92.08,38.73
N$149  (via drill 1 pad 1.78)
  other vias: 92.08,36.45
N$150  (via drill 1 pad 1.78)
  other vias: 92.08,34.16
N$151  (via drill 1 pad 1.9)
  other vias: 133.35,10.16
N$152  (via drill 1 pad 1.9)
  other vias: 148.59,7.62
N$153  (via drill 1 pad 1.9)
  other vias: 148.59,35.56
N$154  (via drill 1 pad 1.9)
  other vias: 146.05,40.64
N$155  (via drill 1 pad 1.9)
  other vias: 143.51,40.64
N$156  (via drill 1 pad 1.9)
  other vias: 140.97,40.64
N$157  (via drill 1 pad 1.9)
  other vias: 138.43,40.64
N$158  (via drill 1 pad 1.9)
  other vias: 135.89,38.1
N$159  (via drill 1 pad 1.9)
  other vias: 135.89,2.54
N$160  (via drill 1 pad 1.9)
  other vias: 135.89,35.56
N$162  (via drill 1 pad 1.9)
  other vias: 133.35,38.1
N$165  (via drill 1 pad 1.9)
  other vias: 151.13,35.56
N$166  (via drill 1 pad 1.9)
  other vias: 151.13,33.02
N$167  (via drill 1 pad 1.9)
  other vias: 151.13,30.48
N$168  (via drill 1 pad 1.9)
  other vias: 151.13,27.94
N$169  (via drill 1 pad 1.9)
  other vias: 151.13,25.4
N$170  (via drill 1 pad 1.9)
  other vias: 151.13,22.86
N$171  (via drill 1 pad 1.9)
  other vias: 151.13,20.32
N$172  (via drill 1 pad 1.9)
  other vias: 151.13,17.78
N$173  (via drill 1 pad 1.9)
  other vias: 151.13,15.24
N$174  (via drill 1 pad 1.9)
  other vias: 151.13,12.7
N$175  (via drill 1 pad 1.9)
  other vias: 151.13,10.16
N$176  (via drill 1 pad 1.9)
  other vias: 133.35,5.08
N$178  (via drill 1 pad 1.9)
  other vias: 133.35,12.7
N$179  (via drill 1 pad 1.9)
  other vias: 133.35,15.24
N$182  (via drill 1 pad 1.9)
  other vias: 133.35,17.78
N$183  (via drill 1 pad 1.9)
  other vias: 133.35,20.32
N$186  (via drill 1 pad 1.9)
  other vias: 133.35,22.86
N$187  (via drill 1 pad 1.9)
  other vias: 133.35,25.4
N$188  (via drill 1 pad 1.9)
  other vias: 135.89,25.4
N$189  (via drill 1 pad 1.9)
  other vias: 133.35,27.94
N$190  (via drill 1 pad 1.9)
  other vias: 133.35,30.48
N$191  (via drill 1 pad 1.9)
  other vias: 133.35,33.02
N$192  (via drill 1 pad 1.9)
  other vias: 133.35,35.56
NC1
  Top 2.54: JP1.3 U1.CLOSED
  Bottom 2.54: JP1.3 21.08,15.24
NC2
  Top 2.54: JP2.3 U2.CLOSED
  Bottom 2.54: JP2.3 38.86,15.24
NC3
  Top 2.54: JP3.3 U3.CLOSED
  Bottom 2.54: JP3.3 56.64,15.24
NC4
  Top 2.54: JP4.3 U4.CLOSED
  Bottom 2.54: JP4.3 74.42,15.24
NO1
  Top 2.54: JP1.1 U1.OPEN
  Bottom 2.54: JP1.1 9.4,15.24
NO2
  Top 2.54: JP2.1 U2.OPEN
  Bottom 2.54: JP2.1 27.18,15.24
NO3
  Top 2.54: JP3.1 U3.OPEN
  Bottom 2.54: JP3.1 44.96,15.24
NO4
  Top 2.54: JP4.1 U4.OPEN
  Bottom 2.54: JP4.1 62.74,15.24
RELAY1  (via drill 0.3)
  Top 0.61: R2.1 v13.46,39.88
  Bottom 0.305: v13.46,39.88 arc-90 15.62,42.04 90.3,42.04 arc-90 91.31,41.02 SJ4.2
RELAY2  (via drill 0.3)
  Top 0.61: R4.1 v31.24,39.88
  Bottom 0.305: v31.24,39.88 arc-90 32.77,41.4 89.15,41.4 arc-90 90.55,39.62 90.55,39.5 arc90 91.19,38.73 SJ3.2
RELAY3  (via drill 0.3)
  Top 0.61: R7.1 v49.02,39.88
  Bottom 0.305: v49.02,39.88 49.02,40.01 arc-90 49.78,40.77 88.77,40.77 arc-90 89.92,39.5 89.92,37.85 arc90 91.31,36.45 SJ2.2
RELAY4  (via drill 0.3)
  Top 0.61: R11.1 v66.8,39.88
  Bottom 0.305: v66.8,39.88 arc-90 67.06,40.13 88.27,40.13 arc-90 89.28,38.99 89.28,35.81 arc90 91.19,34.16 SJ1.2

### Text on the board
tPlace: +
bPlace: D0 | A0 | D1 | A1 | D2 | A2 | D3 | A3 | D4 | A4 | D5 | A5 | USE EXTREME CAUTION WHEN / WORKING WITH HIGH VOLTAGES | D6 | DAC | D7 | WKP | GND | RX | VBAT | TX | COMM | COMM | COMM | COMM | !RST | GND | NO | NC | NO | NC | NO | NC | NO | NC | +3V3 | +5V | GND | GND | + | +
bStop: MSB
tDocu: Reference Designs ARE PROVIDED "AS IS" AND "WITH ALL FAULTS. PARTICLE INDUSTRIES, INC / ("PARTICLE") DISCLAIMS ALL OTHER WARRANTIES, EXPRESS OR IMPLIED, REGARDING / PRODUCTS OR THE REFERENCE DESIGNS, INCLUDING BUT NOT LIMITED TO, ANY / IMPLIED WARRANTIES OF MERCHANTABILITY, FITNESS FOR A PARTICULAR PURPOSE, / OR NON-INFRINGEMENT. / / Particle may make changes to specifications and product descriptions at any / time, without notice. The Customer must not rely on the absence or / characteristics of any features or instructions marked "reserved" or / "undefined." Particle reserves these for future definition and shall have / no responsibility whatsoever for conflicts or incompatibilities arising / from future changes to them. The product information on the Web Site or / Materials is subject to change without notice. Do not finalize a design / with this information. / Particle is a registered trademark.